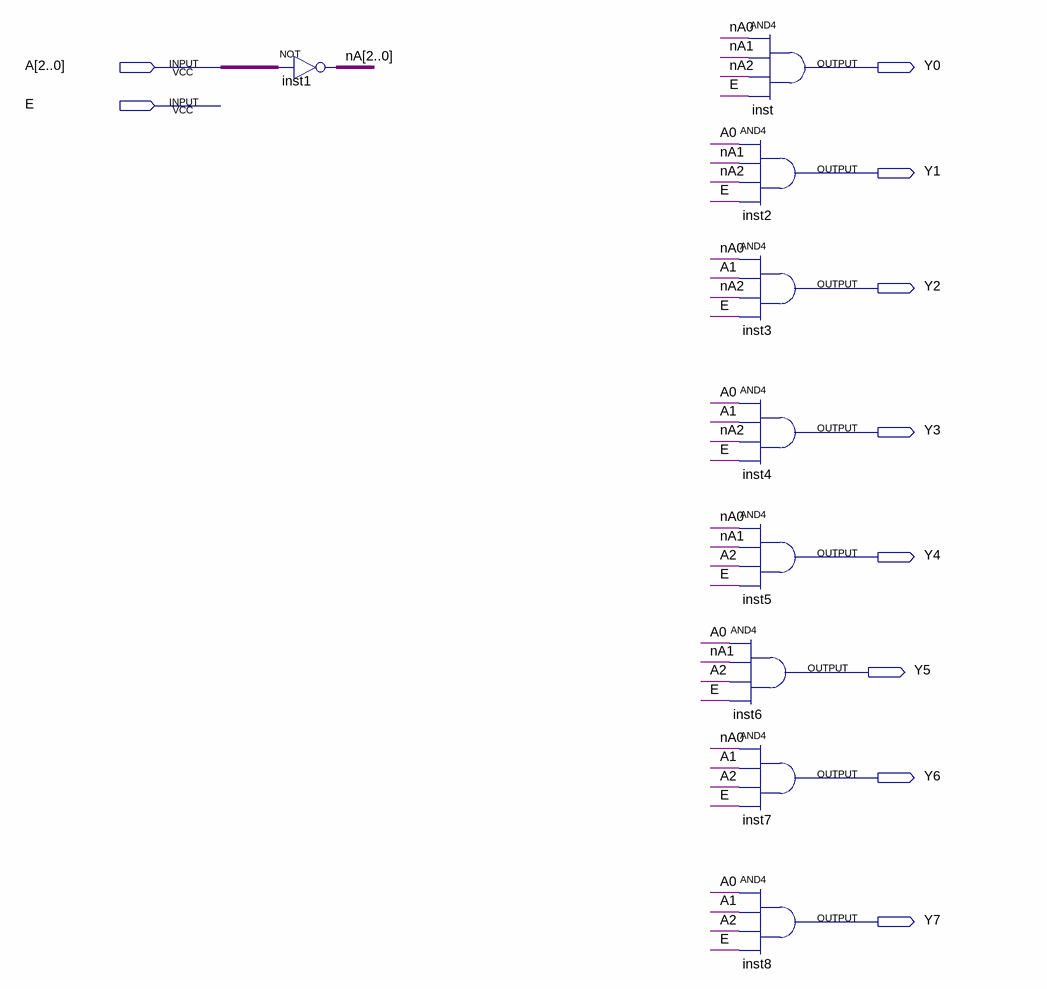
[diagram p0: schematic sheet]
// Quartus schematic DC8T03.bdf as structural Verilog: 9 symbols, 10 pins
module DC8T03 (
  input  [2:0] A,
  input  E,
  output Y0,
  output Y1,
  output Y2,
  output Y3,
  output Y4,
  output Y5,
  output Y6,
  output Y7
);

  wire [2:0] nA;

  assign nA = ~A;  // NOT inst1, 3 bits wide
  // AND4 inst has open pins: IN1=nA[0], IN2=nA[1], IN3=nA[2], IN4=E, OUT=open
  and inst2 (Y1, A[0], nA[1], nA[2], E);
  and inst3 (Y2, nA[0], A[1], nA[2], E);
  and inst4 (Y3, A[0], A[1], nA[2], E);
  and inst5 (Y4, nA[0], nA[1], A[2], E);
  and inst6 (Y5, A[0], nA[1], A[2], E);
  and inst7 (Y6, nA[0], A[1], A[2], E);
  and inst8 (Y7, A[0], A[1], A[2], E);
endmodule
